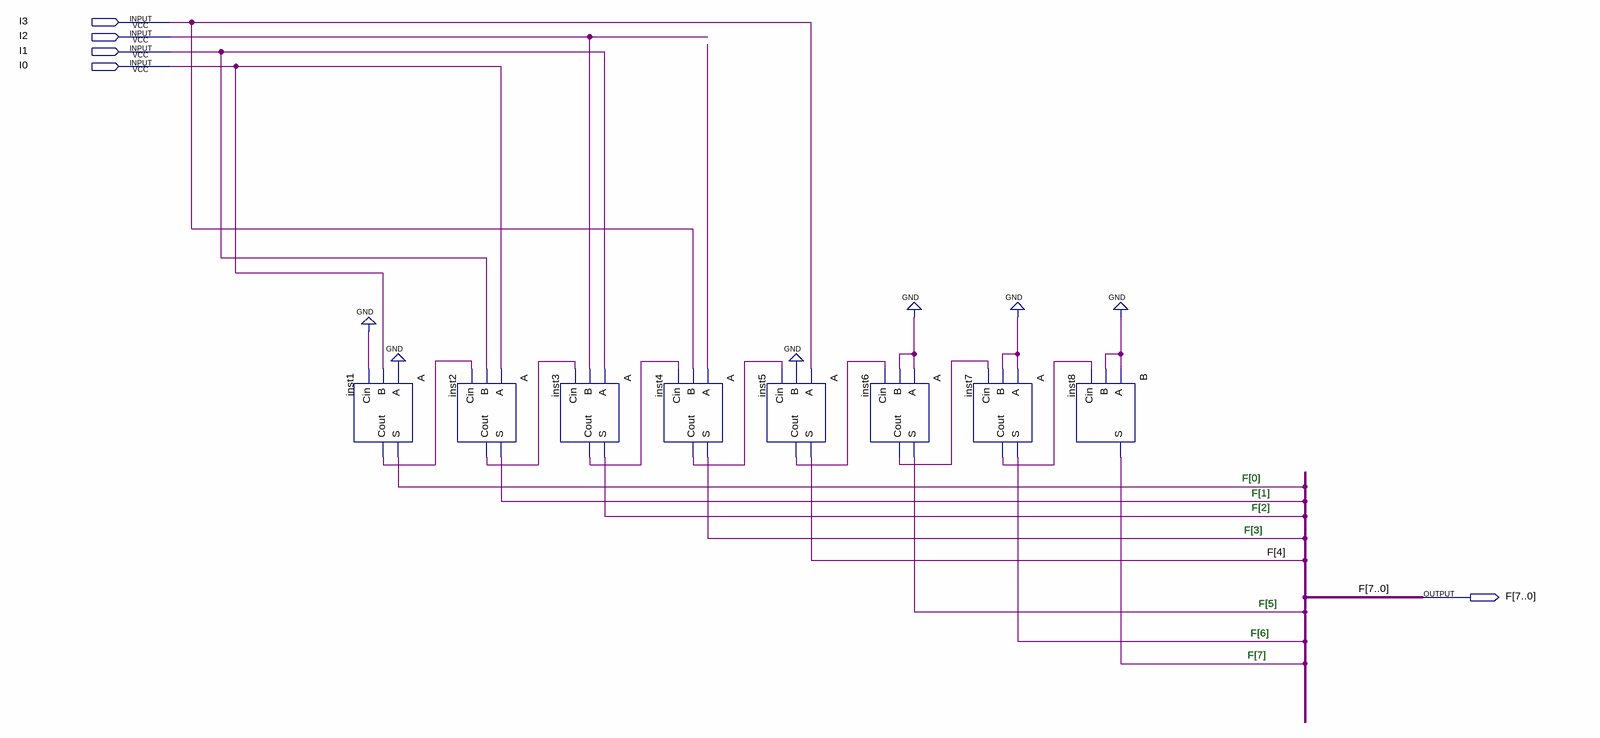
[diagram p0: schematic sheet]
// Quartus schematic LAB3.bdf as structural Verilog: 8 symbols, 5 pins
module LAB3 (
  input  I3,
  input  I2,
  input  I1,
  input  I0,
  output [7:0] F
);

  wire inst1_cout, inst2_cout, inst3_cout, inst4_cout, inst5_cout, inst6_cout, inst7_cout, undriven;

  A inst1 (.A(1'b0), .B(I0), .Cin(1'b0), .S(F[0]), .Cout(inst1_cout));
  A inst2 (.A(I0), .B(I1), .Cin(inst1_cout), .S(F[1]), .Cout(inst2_cout));
  A inst3 (.A(I1), .B(I2), .Cin(inst2_cout), .S(F[2]), .Cout(inst3_cout));
  A inst4 (.A(undriven), .B(I3), .Cin(inst3_cout), .S(F[3]), .Cout(inst4_cout));
  A inst5 (.A(I3), .B(1'b0), .Cin(inst4_cout), .S(F[4]), .Cout(inst5_cout));
  A inst6 (.A(1'b0), .B(1'b0), .Cin(inst5_cout), .S(F[5]), .Cout(inst6_cout));
  A inst7 (.A(1'b0), .B(1'b0), .Cin(inst6_cout), .S(F[6]), .Cout(inst7_cout));
  B inst8 (.A(1'b0), .B(1'b0), .Cin(inst7_cout), .S(F[7]));

  // Notes on the sheet:
  //   F[0]
  //   F[1]
  //   F[2]
  //   F[3]
  //   F[5]
  //   F[6]
  //   F[7]
endmodule
